# EAGLE design emergency (EAGLE 9.7.0)

## Sheet 1 of 2
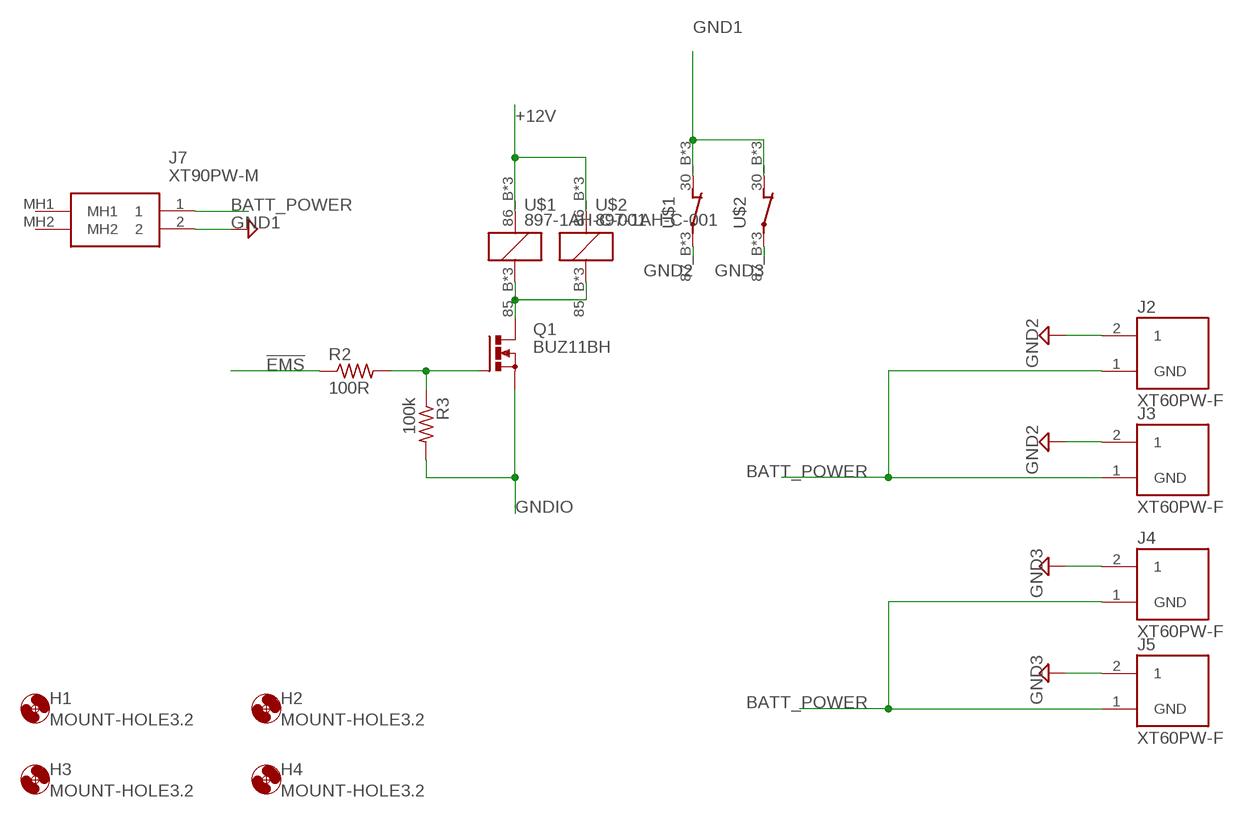
[diagram p0: schematic, sheet 1]

### Parts
H1  MOUNT-HOLE3.2  [3,2]
H2  MOUNT-HOLE3.2  [3,2]
H3  MOUNT-HOLE3.2  [3,2]
H4  MOUNT-HOLE3.2  [3,2]
J2  XT60PW-F  [AMASS_XT60PW-F]
J3  XT60PW-F  [AMASS_XT60PW-F]
J4  XT60PW-F  [AMASS_XT60PW-F]
J5  XT60PW-F  [AMASS_XT60PW-F]
J7  XT90PW-M  [XT90PWM]
Q1  BUZ11BH  [TO220BH]
R2  100R  R-US_R0603  [R0603]
R3  100k  R-US_R0603  [R0603]
U$1  897-1AH-C-001  [897-1AH-C-001]
U$2  897-1AH-C-001  [897-1AH-C-001]

### Nets
!EMS [0.5mm]: R2.1 ; also sheet 2
+12V [0.5mm]: U$1.86_B U$1.86_T U$1.P$4 U$2.86_B U$2.86_T U$2.P$4 ; also sheet 2
BATT_POWER [0.5mm]: J2.1(GND) J3.1(GND) J4.1(GND) J5.1(GND) J7.1
GND1 [0.5mm]: J7.2 U$1.30_B(O) U$1.30_T(O) U$1.P$3(O) U$2.30_B(O) U$2.30_T(O) U$2.P$3(O) ; supply symbol labelled GND2
GND2 [0.5mm]: J2.2 J3.2 U$1.87_B(P) U$1.87_T(P) U$1.P$1(P)
GND3 [0.5mm]: J4.2 J5.2 U$2.87_B(P) U$2.87_T(P) U$2.P$1(P) ; supply symbol labelled GND2
GNDIO [0.5mm]: Q1.S R3.2 ; also sheet 2
N$3 [1mm]: Q1.D U$1.85_B U$1.85_T U$1.P$2 U$2.85_B U$2.85_T U$2.P$2
N$7 [0.5mm]: Q1.G R2.2 R3.1
Unconnected: J7.MH1 J7.MH2

## Sheet 2 of 2
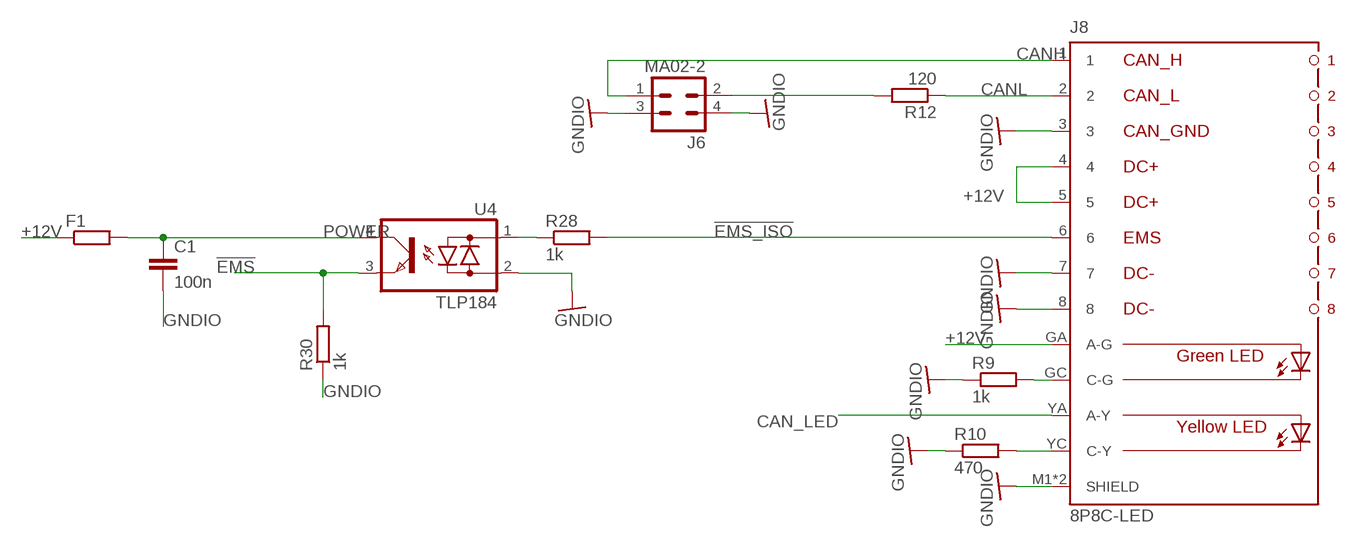
[diagram p1: schematic, sheet 2]

### Parts
C1  100n  C-EUC0603  [C0603]
F1  R-EU_R1206  [R1206]
J6  MA02-2  [MA02-2W]
J8  8P8C-LED  [8P8C-LED]
R9  1k  R-EU_R0603  [R0603]
R10  470  R-EU_R0603  [R0603]
R12  120  R-EU_R0603  [R0603]
R28  1k  R-EU_R0603  [R0603]
R30  1k  R-EU_R0603  [R0603]
U4  TLP184  [11-4M1S]

### Nets
!EMS [0.5mm]: R30.2 U4.3(E) ; also sheet 1
!EMS_ISO [0.5mm]: J8.6 R28.2
+12V [0.5mm]: F1.1 J8.4 J8.5 J8.GA(A-G) ; also sheet 1
CAN_LED: J8.YA(A-Y)
CANH [0.5mm]: J6.1 J8.1
CANL [0.5mm]: J8.2 R12.1
GNDIO [0.5mm]: C1.2 J6.3 J6.4 J8.3 J8.7 J8.8 J8.M1(SHIELD) J8.M2(SHIELD) R9.1 R10.1 R30.1 U4.2(AC2) ; also sheet 1
N$5: J8.GC(C-G) R9.2
N$9 [0.5mm]: J6.2 R12.2
N$10: J8.YC(C-Y) R10.2
N$30 [0.5mm]: R28.1 U4.1(AC1)
POWER [0.5mm]: C1.1 F1.2 U4.4(C)

## Library data of the parts
C1 = rcl:C-EU: CAPACITOR, European symbol; SPICEPREFIX: C
F1 R9 R10 R12 R28 R30 = rcl:R-EU_: RESISTOR, European symbol; SPICEPREFIX: R
H1-H4 = holes:MOUNT-HOLE: MOUNTING HOLE with drill center marker
J2-J5 = con-xt:XT60PW-F
J6 = con-headers:MA02-2
J7 = XT90PW-M:XT90PW-M: Socket; DC supply; XT90; male; PIN: 2; on PCBs; THT; Colour: yellow Source: Datasheet <https://www.tme.com/Document/7357a049cc8e5ea73e34d2124a313a81/XT90PW.pdf>; DESCRIPTION: Socket; DC supply; XT90; male; PIN: 2; on PCBs; THT; Colour: yellow; HEIGHT: 10.3mm; MANUFACTURER_NAME: Amass; MANUFACTURER_PART_NUMBER: XT90PW-M
J8 = con-rj45:8P8C-LED: generic 8P8C connector with two LED's; OC_FARNELL: unknown; OC_NEWARK: unknown
Q1 = transistor-power:BUZ11: N-CHANNEL MOS FET
R2 R3 = rcl:R-US_: RESISTOR, American symbol; SPICEPREFIX: R
U4 = md201x:TLP184
U$1 U$2 = CRS_EAGLE_Lib:897-1AH-C-001

## Net classes
1 1mm: width 1 mm
2 0.5mm: width 0.5 mm

## Board
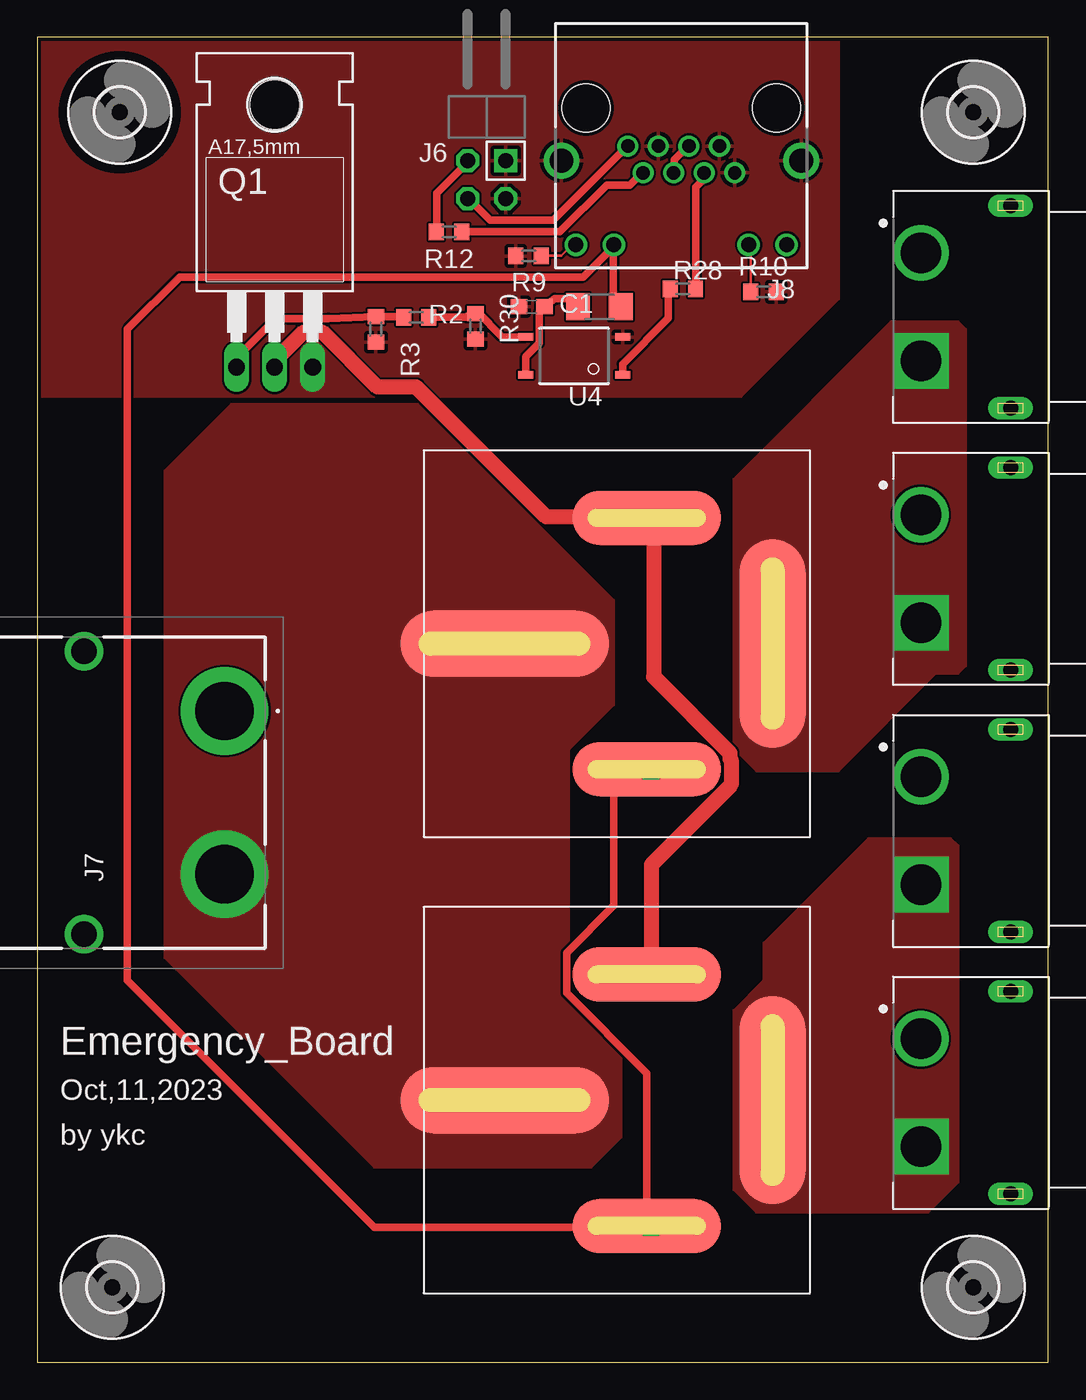
[diagram p2: board, top side]
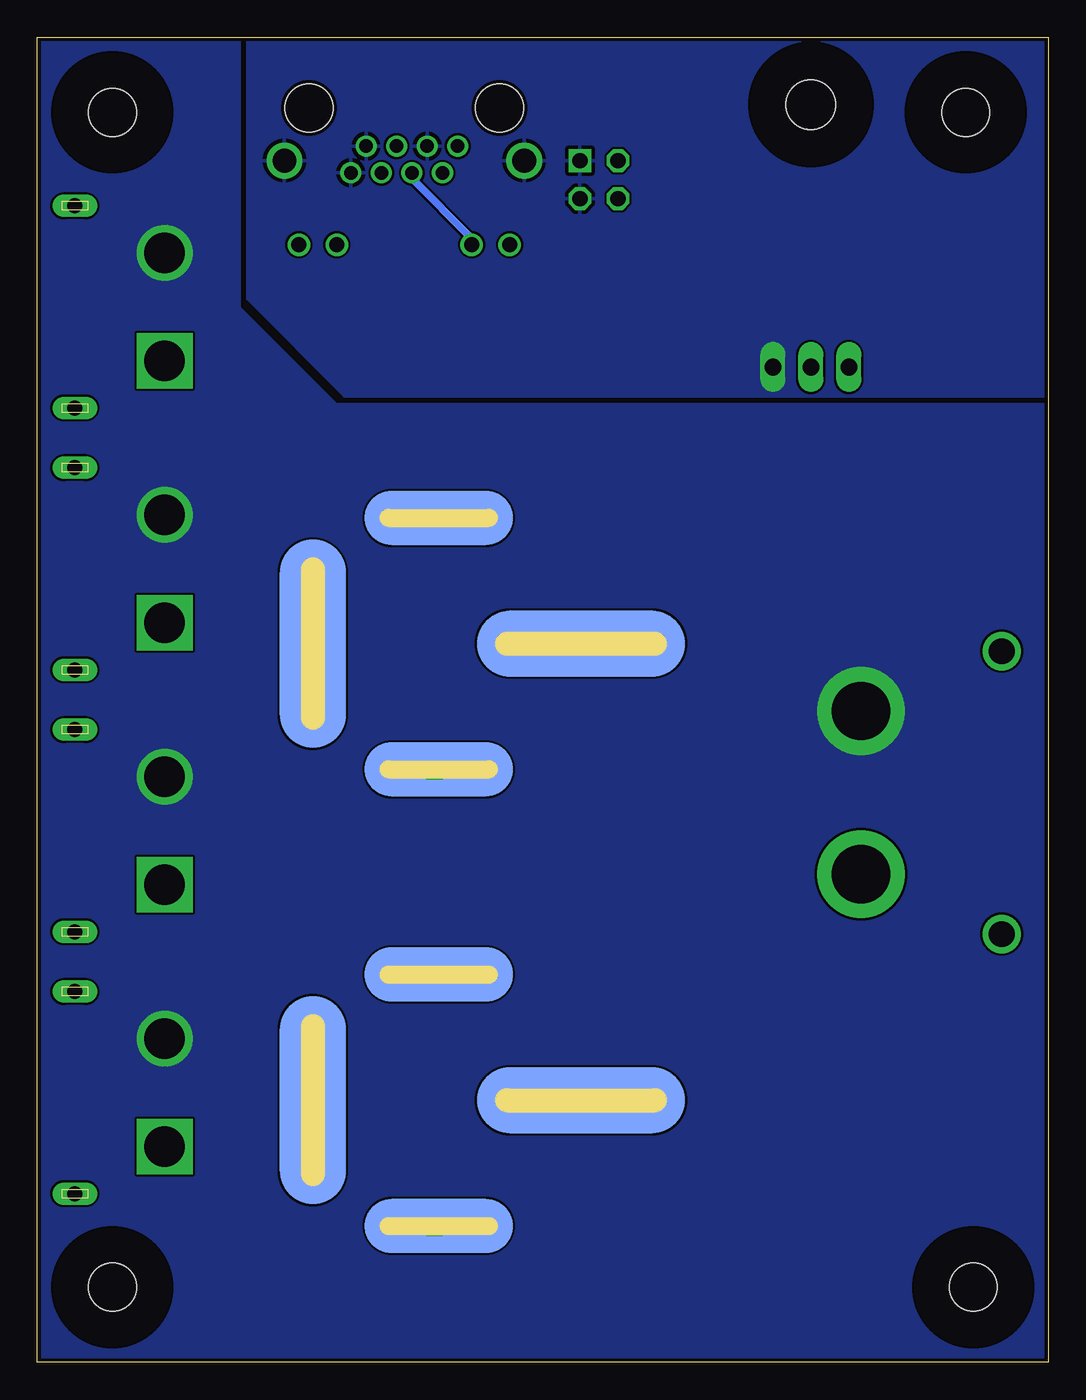
[diagram p3: board, bottom side, seen from below]

Size 67.5 x 88.5 mm. Coordinates in mm from the lower left corner, seen from the top.
Outline: 0,0 67.5,0 67.5,88.5 0,88.5 0,0
Copper layers (1*16): Top 0.035mm / dielectric 1.5mm / Bottom 0.035mm
Design rules "SeeedStudio_2layer_DRU_no_angle_20140221": minimum track width 6mil, minimum drill 12mil, track to track 6mil, track to pad 6mil, pad to pad 6mil, via to via 6mil, smd to smd 0mil, copper to edge 10mil, drill to drill 10mil, minimum pad ring 10mil, minimum via ring 6mil, stop-mask expansion 2mil, vias tented up to drill 100mil, thermal gap 10mil

### Footprints (pad centres in the part's own frame; a part is rotated, then mirrored left to right if it is on the bottom)
C0603 = smd 1.1 x 1: 1 -0.85,0; 2 0.85,0
R1206 = smd 1.6 x 1.803: 1 -1.422,0; 2 1.422,0
3,2 = hole 3.2: 0,0
AMASS_XT60PW-F = drill 2.7: 1 -3.6,-6 | drill 2.7 square: 2 3.6,-6 | drill 1 pad 1.2 long: S1 -6.75,0; S2 6.75,0
MA02-2W = drill 1.016 octagon: 1 -1.27,-1.27; 2 -1.27,1.27; 3 1.27,-1.27 | drill 1.016 square: 4 1.27,1.27
XT90PWM = drill 3.9 pad 5.85: 1 0,0; 2 10.9,0 | drill 1.71 pad 2.565: MH1 -4,-9.4; MH2 14.9,-9.4
8P8C-LED = drill 0.9 pad 1.3: 1 3.57,-3.81; 2 2.55,-2.03; 3 1.53,-3.81; 4 0.51,-2.03; 5 -0.51,-3.81; 6 -1.53,-2.03; 7 -2.55,-3.81; 8 -3.57,-2.03 | drill 1 pad 1.422: GA 4.5,2.78; GC 7.04,2.78; YA -7.04,2.78; YC -4.5,2.78 | drill 1.6 pad 2.184: M1 -8,-2.85; M2 8,-2.85 | hole 3.2: 6.35,-6.35; -6.35,-6.35
TO220BH = drill 1.118 long: D 0,-6.35; G -2.54,-6.35; S 2.54,-6.35 | hole 3.302: 0,11.176
R0603 = smd 1 x 1.1: 1 -0.85,0; 2 0.85,0
11-4M1S = smd 1 x 0.5: 1 -3.24,1.27; 2 -3.24,-1.27; 3 3.24,-1.27; 4 3.24,1.27
897-1AH-C-001 = smd 4.4 x 13.9 bottom: 30_B 0,-7.5 | smd 4.4 x 13.9: 30_T 0,-7.5 | smd 3.6 x 9.9 bottom: 85_B -8.4,2; 86_B 8.4,2 | smd 3.6 x 9.9: 85_T -8.4,2; 86_T 8.4,2 | smd 13.9 x 4.4 bottom: 87_B 0,10.4 | smd 13.9 x 4.4: 87_T 0,10.4 | drill 0.6 square: P$1 0,10.414; P$2 -8.382,2.286; P$3 0,-7.62; P$4 8.509,2.286

### Placement (x,y rotation side)
C1  33,70.5 180 top
F1  37.52,70.5 180 top
H1  5,5 0 top
H2  5.5,83.5 0 top
H3  62.5,83.5 0 top
H4  62.5,5 0 top
J2  65,70.5 270 top
J3  65,53 270 top
J4  65,35.5 270 top
J5  65,18 270 top
J6  30,79 0 top
J7  12.5,43.5 270 top
J8  43,77.43 180 top
Q1  15.84,72.83 0 top
R2  25.3,69.8 180 top
R3  22.6,69 270 top
R9  32.8,73.9 0 top
R10  48.5,71.5 180 top
R12  27.5,75.5 180 top
R28  43.1,71.7 0 top
R30  29.25,69.2 90 top
U4  35.84,67.22 180 top
U$1  38.7,48 270 top
U$2  38.7,17.5 270 top

### Tracks (layer width: path | path; a pad name or v marks a point on that pad's centre or on a via)
!EMS
  Top 0.5: U4.3 31.04,68.49 29.36,70.17 R30.2 28.9,70.05 28.65,69.8 R2.1
!EMS_ISO
  Top 0.5: R28.2 43.97,71.7 43.97,78.49 44.5,79.02 44.5,79.4 J8.6
+12V
  Top 0.5: J8.4 42.52,79.48 42.52,80.31 43.43,81.23 J8.5 | 38.45,74.01 38.6,74.48 38.48,74.6 J8.GA | 38.45,74.01 38.45,73 38.45,71 F1.1 38.87,70.49 | 38.45,74.01 38.45,74.5 36.45,72.5 9.5,72.5 6,69 6,25.5 22.51,8.99 U$2.P$4 | 40.69,39.55 U$1.P$4 39.99,39.49 38.5,38 38.5,30.5 35.35,27.35 35.35,24.65 40.7,19.3 U$2.86_T
  Bottom 0.5: J8.4 42.44,79.4 42.44,79.02 38.56,75.13 38.56,74.68 J8.GA | 41.6,39.55 41,39.55 U$1.P$4
BATT_POWER
  pour Bottom (no thermals): 53.99,70.49 47.51,64.01 47.48,64 0,64 0,0 67.5,0 67.5,88.5 54,88.5 54,70.52
CANH
  Top 0.5: J8.1 39.4,81.23 34.44,76.28 30.25,76.28 28.8,77.72 J6.1
CANL
  Top 0.5: R12.1 28.42,75.51 34.9,75.51 38.02,78.64 39.55,78.64 40.39,79.48 J8.2
GND1
  pour Top (no thermals): 35.51,23.99 35.5,24.02 35.5,40.88 35.51,40.91 38.5,43.9 38.5,50.9 25.4,64 12.96,64 8.5,59.54 8.5,27 22.5,13 37,13 39,15 39,20.5
GND2
  Bottom 0.5: U$1.87_T 49.15,48.01 U$1.P$1
  pour Top (no thermals): 59.99,45.99 60.02,46 61.5,46 62,46.5 62,69 61.5,69.5 57,69.5 46.5,59 46.5,41 48,39.5 53.5,39.5
GND3
  Bottom 0.5: U$2.87_T 49.15,17.53 U$2.P$1
  pour Top (no thermals): 48.5,25.52 48.49,25.49 46.5,23.5 46.5,11.5 48,10 59.5,10 61.5,12 61.5,34.5 61,35 55.5,35 48.5,28
GNDIO
  pour Bottom: 0,64.5 47,64.5 53.5,71 53.5,88.5 0,88.5
  pour Top: 0,64.5 47,64.5 53.5,71 53.5,88.5 0,88.5
N$3
  Top 1: Q1.D 15.85,66.52 15.85,66.9 17.75,68.81 19.05,68.81 22.71,65.15 25.3,65.15 33.98,56.46 40.69,56.46 U$1.P$2 41.15,55.93 41.15,45.8 46.25,40.69 46.25,40.31 46.33,40.23 46.33,38.56 41,33.22 41,25.91 U$2.P$2
N$5
  Top 0.152: R9.2 33.68,73.91 34.98,73.91 35.66,74.6 35.89,74.6 J8.GC
N$7
  Top 0.5: R2.2 24.4,69.85 R3.1 19.43,69.72 15.93,69.72 13.34,67.13 13.34,66.52 Q1.G
N$9
  Top 0.5: R12.2 26.67,75.51 26.67,78.11 28.8,80.24 J6.2
N$10
  Top 0.152: R10.2 47.62,71.55 47.62,74.52 47.55,74.6 J8.YC
N$30
  Top 0.5: U4.1 39.09,66.02 39.09,66.68 42.14,69.73 42.14,71.55 42.22,71.63 R28.1
POWER
  Top 0.5: U4.4 32.61,66.02 32.61,67.19 33.51,68.08 33.51,70.16 33.79,70.44 C1.1 34.54,71.05 35.37,71.05 F1.2

### Text on the board
tNames: Emergency_Board | Oct,11,2023 | by ykc